# EAGLE design RxBrd_v2 (EAGLE 7.2.0)
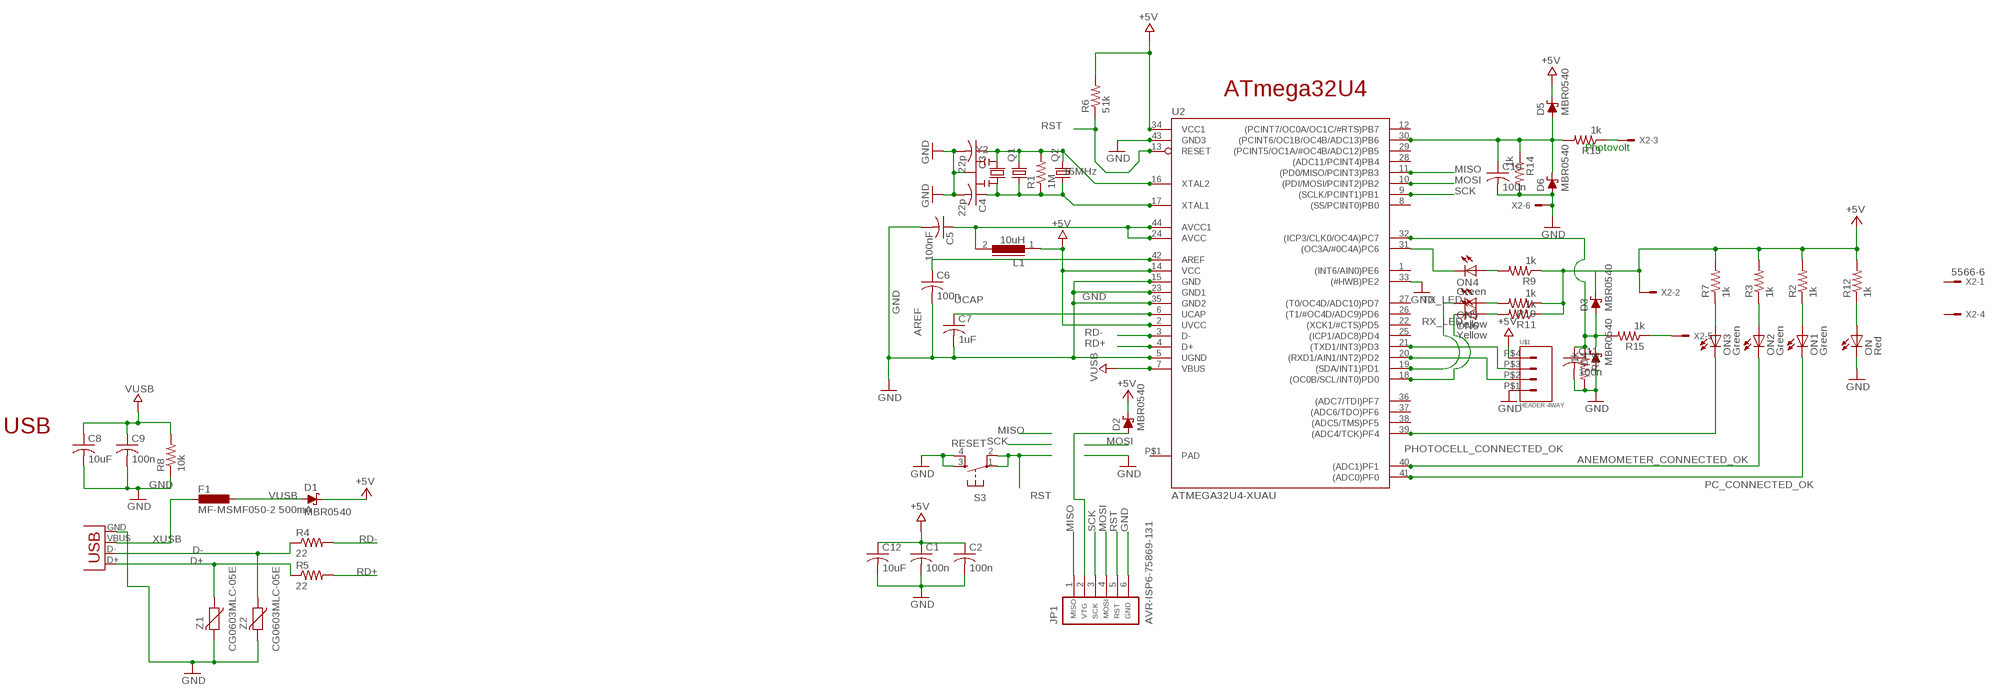
[diagram p0: schematic, sheet 1]

## Parts
C1  100n  C-USC0805  [C0805]
C2  100n  C-USC0805  [C0805]
C3  22p  C-USC0805  [C0805]
C4  22p  C-USC0805  [C0805]
C5  100nF  C-USC0805  [C0805]
C6  100n  C-USC0805  [C0805]
C7  1uF  C-USC0805  [C0805]
C8  10uF  C-USC0805  [C0805]
C9  100n  C-USC0805  [C0805]
C10  100n  C-USC0805  [C0805]
C11  100n  C-USC0805  [C0805]
C12  10uF  C-USC0805  [C0805]
D1  MBR0540  [SOD123@2]
D2  MBR0540  [SOD123@2]
D3  MBR0540  [SOD123@2]
D4  MBR0540  [SOD123@2]
D5  MBR0540  [SOD123@2]
D6  MBR0540  [SOD123@2]
F1  MF-MSMF050-2 500mA  L-EUL1812  [L1812]
JP1  AVR-ISP6-75869-131  [HDR-75869-131]
L1  10uH  MMICC7  [MMICC7]
ON  Red  LEDCHIPLED_0805  [CHIPLED_0805]
ON1  Green  LEDCHIPLED_0805  [CHIPLED_0805]
ON2  Green  LEDCHIPLED_0805  [CHIPLED_0805]
ON3  Green  LEDCHIPLED_0805  [CHIPLED_0805]
ON4  Green  LEDCHIPLED_0805  [CHIPLED_0805]
ON5  Yellow  LEDCHIPLED_0805  [CHIPLED_0805]
ON6  Yellow  LEDCHIPLED_0805  [CHIPLED_0805]
Q1  CRYSTALHC49UP  [HC49UP]
Q2  CRYSTALHC49S  [HC49/S]
R1  1M  R-US_R0805  [R0805]
R2  1k  R-US_R0805  [R0805]
R3  1k  R-US_R0805  [R0805]
R4  22  R-US_R0805  [R0805]
R5  22  R-US_R0805  [R0805]
R6  51k  R-US_R0805  [R0805]
R7  1k  R-US_R0805  [R0805]
R8  10k  R-US_R0805  [R0805]
R9  1k  R-US_R0805  [R0805]
R10  1k  R-US_R0805  [R0805]
R11  1k  R-US_R0805  [R0805]
R12  1k  R-US_R0805  [R0805]
R13  1k  R-US_R0805  [R0805]
R14  1k  R-US_R0805  [R0805]
R15  1k  R-US_R0805  [R0805]
R16  1k  R-US_R0805  [R0805]
S3  RESET  TAC_SWITCHSMD  [TACTILE_SWITCH_SMD]
U2  ATMEGA32U4-XUAU  [TQFP44-PAD]
U$1  HEADER-4WAY  [1744426-4]
X1  USBPTH  [USB-B-PTH]
X2  5566-6  [5566-6]
Y2  16MHz  RESONATORMU  [RESONATOR]
Z1  CG0603MLC-05E  VARISTORCN0603  [CT/CN0603]
Z2  CG0603MLC-05E  VARISTORCN0603  [CT/CN0603]

## Nets
+5V [usbvcc]: C1.1 C2.1 C12.1 D1.C D2.C D3.C D5.C L1.1 R2.2 R3.2 R6.2 R7.2 R9.1 R10.1 R11.1 R12.2 U2.2(UVCC) U2.14(VCC) U2.34(VCC1) U$1.P$4 X2.2
ANEMOMETER_CONNECTED_OK: ON2.C U2.40((ADC1)PF1)
AREF [aref]: C6.1 U2.42(AREF)
AVCC: C5.1 L1.2 U2.24(AVCC) U2.44(AVCC1)
D+: R5.1 X1.D+ Z1.1
D-: R4.1 X1.D- Z2.1
GND [gnd]: C1.2 C2.2 C3.2 C4.2 C5.2 C6.2 C7.2 C8.2 C9.2 C10.2 C11.2 C12.2 D4.A D6.A JP1.6 ON.C R8.1 R14.2 R16.2 S3.3 S3.4 U2.5(UGND) U2.15(GND) U2.23(GND1) U2.33((#HWB)PE2) U2.35(GND2) U2.43(GND3) U$1.P$1 X1.GND X2.6 Y2.2 Z1.2 Z2.2
MISO: JP1.1 U2.11((PD0/MISO/PCINT3)PB3)
MOSI: JP1.4 U2.10((PDI/MOSI/PCINT2)PB2)
N$1: C11.1 D3.A D4.C R15.2 R16.1 U2.32((ICP3/CLK0/OC4A)PC7)
N$2: ON3.A R7.1
N$3: ON.A R12.1
N$4: R13.1 X2.3
N$5: C10.1 D5.A D6.C R13.2 R14.1 U2.30((PCINT6/OC1B/OC4B/ADC13)PB6)
N$6: ON4.A R9.2
N$7: U2.20((RXD1/AIN1/INT2)PD2) U$1.P$2
N$8: U2.21((TXD1/INT3)PD3) U$1.P$3
N$9: ON2.A R3.1
N$10 [usbvcc]: D2.A JP1.2
N$11: ON1.A R2.1
N$12: ON5.A R10.2
N$13: ON4.C U2.31((OC3A/#0C4A)PC6)
N$14: ON6.A R11.2
N$15: R15.1 X2.5
PC_CONNECTED_OK: ON1.C U2.41((ADC0)PF0)
PHOTOCELL_CONNECTED_OK: ON3.C U2.39((ADC4/TCK)PF4)
RD+: R5.2 U2.4(D+)
RD-: R4.2 U2.3(D-)
RST: JP1.5 R6.1 S3.1 S3.2 U2.13(RESET)
RX_LED: ON6.C U2.18((OC0B/SCL/INT0)PD0)
SCK: JP1.3 U2.9((SCLK/PCINT1)PB1)
TX_LED: ON5.C U2.19((SDA/INT1)PD1)
UCAP: C7.1 U2.6(UCAP)
VUSB: C8.1 C9.1 D1.A F1.1 R8.2 U2.7(VBUS)
XTAL1: C4.1 Q1.1 Q2.1 R1.1 U2.17(XTAL1) Y2.3
XTAL2: C3.1 Q1.2 Q2.2 R1.2 U2.16(XTAL2) Y2.1
XUSB [usbvcc]: F1.2 X1.VBUS
Unconnected: U2.1((INT6/AIN0)PE6) U2.8((SS/PCINT0)PB0) U2.12((PCINT7/OC0A/OC1C/#RTS)PB7) U2.22((XCK1/#CTS)PD5) U2.25((ICP1/ADC8)PD4) U2.26((T1/#OC4D/ADC9)PD6) U2.27((T0/OC4D/ADC10)PD7) U2.28((ADC11/PCINT4)PB4) U2.29((PCINT5/OC1A/#OC4B/ADC12)PB5) U2.36((ADC7/TDI)PF7) U2.37((ADC6/TDO)PF6) U2.38((ADC5/TMS)PF5) X2.1 X2.4

## Notes on the sheet
- ATmega32U4
- Photovolt
- USB

## Power pins joined to a net without a drawn wire
PAD: U2.P$1(PAD)

## Library data of the parts
C1-C12 = resistor:C-US: CAPACITOR, American symbol
D1-D6 = diode:MBR0540: schottky diode, 0.5A, 40V ON Semiconductor
F1 = rcl:L-EU: INDUCTOR, European symbol
JP1 = atmel-avr:AVR-ISP6-: AVR ISP-6 Serial Programming Header
L1 = inductors:MMICC7: INDUCTOR
ON ON1-ON6 = led:LED: LED OSRAM: - CHIPLED LG R971, LG N971, LY N971, LG Q971, LY Q971, LO R971, LY R971 LH N974, LH R974 LS Q976, LO Q976, LY Q976 LO Q996 - Hyper CHIPLED LW Q18S LB Q993, LB Q99A, LB R99A - SideLED LS A670, LO A670, LY A670, LG A670, LP A670 LB A673, LV A673, LT A673, LW A673 LH A674 LY A675 LS A676, LA A676, LO A676, LY A676, LW A676 LS A679, LY A679, LG A679 - Hyper Micro SIDELED® LS Y876, LA Y876, LO Y876, LY Y876 LT Y87S - SmartLED LW L88C, LW L88S LB L89C, LB L89S, LG L890 LS L89K, LO L89K, LY L89K LS L896, LA L896, LO L896, LY L896 - TOPLED LS T670, LO T670, LY T670, LG T670, LP T670 LSG T670, LSP T670, LSY T670, LOP T670, LYG T670 LG T671, LOG T671, LSG T671 LB T673, LV T673, LT T673, LW T673 LH T674 LS T676, LA T676, LO T676, LY T676, LB T676, LH T676, LSB T676, LW T676 LB T67C, LV T67C, LT T67C, LS T67K, LO T67K, LY T67K, LW E67C LS E67B, LA E67B, LO E67B, LY E67B, LB E67C, LV E67C, LT E67C LW T67C LS T679, LY T679, LG T679 LS T770, LO T770, LY T770, LG T770, LP T770 LB T773, LV T773, LT T773, LW T773 LH T774 LS E675, LA E675, LY E675, LS T675 LS T776, LA T776, LO T776, LY T776, LB T776 LHGB T686 LT T68C, LB T68C - Hyper Mini TOPLED® LB M676 - Mini TOPLED Santana® LG M470 LS M47K, LO M47K, LY M47K Source: http://www.osram.convergy.de LUXEON: - LUMILED® LXK2-PW12-R00, LXK2-PW12-S00, LXK2-PW14-U00, LXK2-PW14-V00 LXK2-PM12-R00, LXK2-PM12-S00, LXK2-PM14-U00 LXK2-PE12-Q00, LXK2-PE12-R00, LXK2-PE12-S00, LXK2-PE14-T00, LXK2-PE14-U00 LXK2-PB12-K00, LXK2-PB12-L00, LXK2-PB12-M00, LXK2-PB14-N00, LXK2-PB14-P00, LXK2-PB14-Q00 LXK2-PR12-L00, LXK2-PR12-M00, LXK2-PR14-Q00, LXK2-PR14-R00 LXK2-PD12-Q00, LXK2-PD12-R00, LXK2-PD12-S00 LXK2-PH12-R00, LXK2-PH12-S00 LXK2-PL12-P00, LXK2-PL12-Q00, LXK2-PL12-R00 Source: www.luxeon.com KINGBRIGHT: KA-3528ASYC Source: www.kingbright.com
Q1 = crystal:CRYSTAL: CRYSTAL; OC_FARNELL: unknown; OC_NEWARK: unknown
Q2 = crystal:CRYSTAL: CRYSTAL; OC_FARNELL: 1667008; OC_NEWARK: unknown
R1-R16 = resistor:R-US_: RESISTOR, American symbol
S3 = SparkFun:TAC_SWITCH: Momentary Switch Button commonly used for reset or general input. Spark Fun Electronics SKU : COM-00097
U2 = SmartPrj:ATMEGA32U4-XU
U$1 = con-TE-EP:HEADER-4WAY
X1 = SparkFun:USB: USB Connectors USB-B-PTH is fully proven SKU : PRT-00139 USB-miniB is fully proven SKU : PRT-00587 USB-A-PCB is untested. USB-A-H is throughly reviewed, but untested. Spark Fun Electronics SKU : PRT-00437 USB-B-SMT is throughly reviewed, but untested. Needs silkscreen touching up. USB-A-S has not been used/tested USB-MB-H has not been used/tested
X2 = con-molex:5566-6: Mini FIT connector 6 pol Source: http://www.molex.com; MPN: 95566-61002; OC_FARNELL: unknown; OC_NEWARK: 22K8620
Y2 = SmartPrj:RESONATOR
Z1 Z2 = varistor:VARISTOR: VARISTOR

## Net classes
0 default: width 0.152 mm, drill 0.305 mm, clearance 0.152 mm
1 power: width 0.254 mm, drill 0.61 mm, clearance 0.254 mm
2 gnd: width 0.254 mm, drill 0.61 mm, clearance 0.254 mm
3 usbvcc: width 0.254 mm, drill 0.61 mm, clearance 0.254 mm
4 aref: width 0.254 mm, drill 0.61 mm, clearance 0.254 mm

## Board
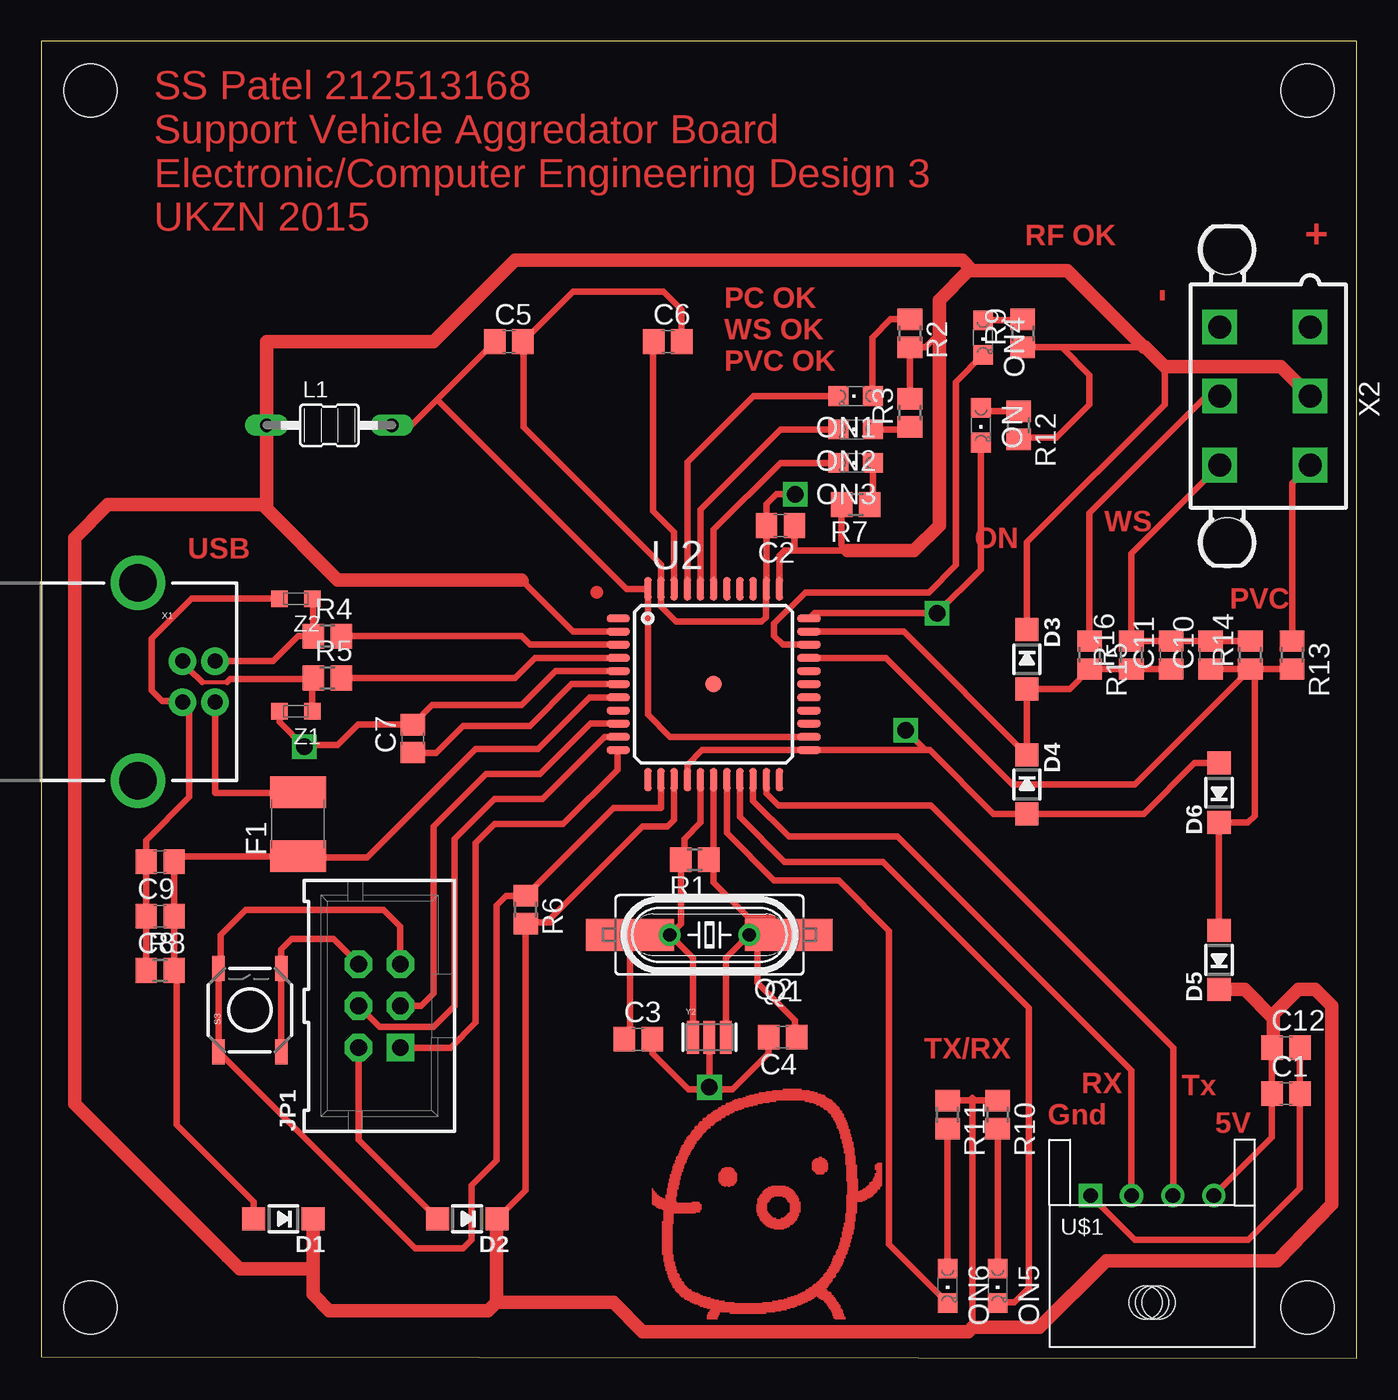
[diagram p1: board, top side]
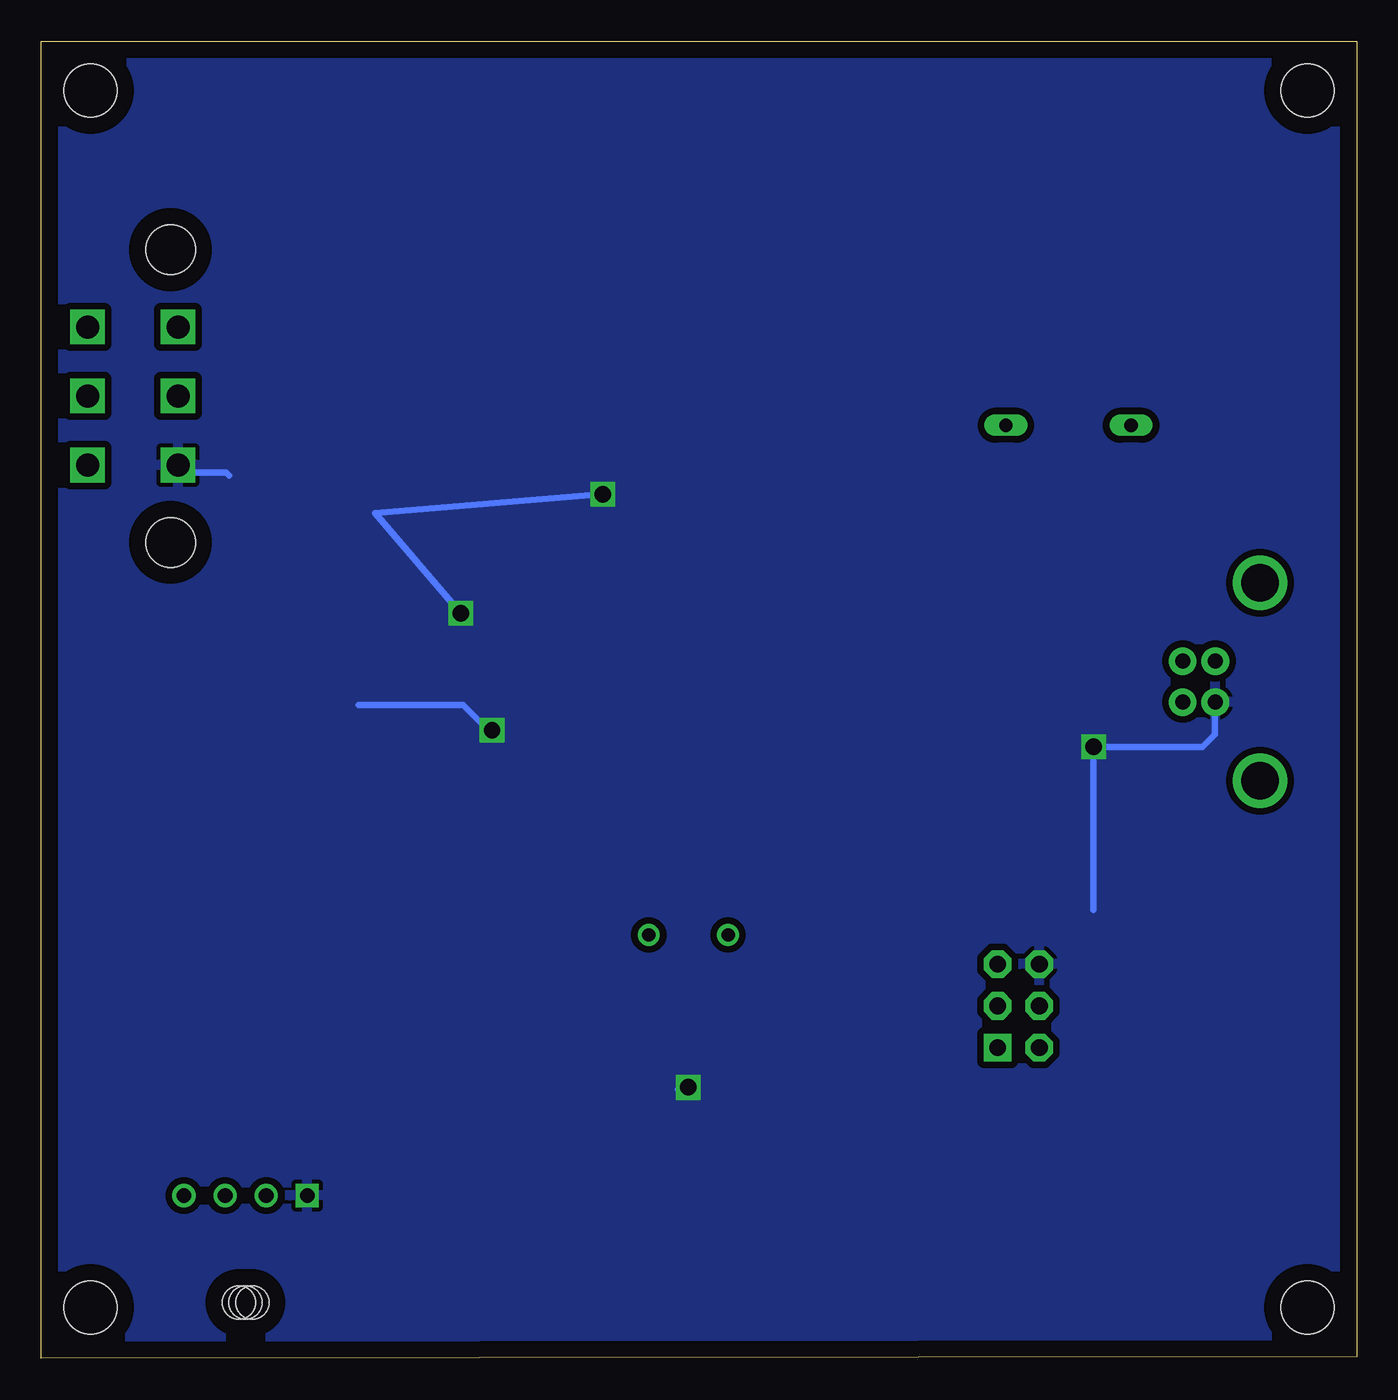
[diagram p2: board, bottom side, seen from below]

Size 80 x 80.1 mm. Coordinates in mm from the lower left corner, seen from the top.
Outline: 0,0.1 80,0 80,80.1 0,80.1 0,0.1
Copper layers (1*16): Top 0.035mm / dielectric 1.5mm / Bottom 0.035mm
Design rules "default": minimum track width 10mil, minimum drill 24mil, track to track 8mil, track to pad 8mil, pad to pad 8mil, via to via 8mil, smd to smd 8mil, copper to edge 40mil, drill to drill 8mil, minimum pad ring 10mil, minimum via ring 8mil, stop-mask expansion 4mil, vias tented up to drill 0mil, thermal gap 10mil
Holes 3.2 mm at 3,3.1 77,3.1 77,77.1 3,77.1

### Footprints (pad centres in the part's own frame; a part is rotated, then mirrored left to right if it is on the bottom)
C0805 = smd 1.3 x 1.5: 1 -0.85,0; 2 0.85,0
SOD123@2 = smd 1.4 x 1.4: A 1.805,0; C -1.805,0
L1812 = smd 1.9 x 3.4: 1 -1.95,0; 2 1.95,0
HDR-75869-131 = drill 1.016 pad 1.676 square: 1 -2.54,-1.27 | drill 1.016 pad 1.676 octagon: 2 -2.54,1.27; 3 0,-1.27; 4 0,1.27; 5 2.54,-1.27; 6 2.54,1.27
MMICC7 = drill 0.813 long: 1 -3.81,0; 2 3.81,0
CHIPLED_0805 = smd 1.2 x 1.2: A 0,-1.05; C 0,1.05
HC49UP = smd 5.334 x 1.93: 1 -4.826,0; 2 4.826,0
HC49/S = drill 0.813: 1 -2.413,0; 2 2.413,0
R0805 = smd 1.3 x 1.5: 1 -0.85,0; 2 0.85,0
TACTILE_SWITCH_SMD = smd 1.524 x 0.762: 1 -2.54,1.905; 2 2.54,1.905; 3 -2.54,-1.905; 4 2.54,-1.905
TQFP44-PAD = smd 1.4 x 0.45: 1 -5.8,4; 2 -5.8,3.2; 3 -5.8,2.4; 4 -5.8,1.6; 5 -5.8,0.8; 6 -5.8,0; 7 -5.8,-0.8; 8 -5.8,-1.6; 9 -5.8,-2.4; 10 -5.8,-3.2; 11 -5.8,-4; 23 5.8,-4; 24 5.8,-3.2; 25 5.8,-2.4; 26 5.8,-1.6; 27 5.8,-0.8; 28 5.8,0; 29 5.8,0.8; 30 5.8,1.6; 31 5.8,2.4; 32 5.8,3.2; 33 5.8,4 | smd 0.45 x 1.4: 12 -4,-5.8; 13 -3.2,-5.8; 14 -2.4,-5.8; 15 -1.6,-5.8; 16 -0.8,-5.8; 17 0,-5.8; 18 0.8,-5.8; 19 1.6,-5.8; 20 2.4,-5.8; 21 3.2,-5.8; 22 4,-5.8; 34 4,5.8; 35 3.2,5.8; 36 2.4,5.8; 37 1.6,5.8; 38 0.8,5.8; 39 0,5.8; 40 -0.8,5.8; 41 -1.6,5.8; 42 -2.4,5.8; 43 -3.2,5.8; 44 -4,5.8 | smd 1 x 1: P$1 0,0
1744426-4 = drill 0.9 square: P$1 -3.75,6.5 | drill 0.9: P$2 -1.25,6.5; P$3 1.25,6.5; P$4 3.75,6.5 | hole 2: 0,0; -0.4,0; 0.4,0
USB-B-PTH = drill 0.914 pad 1.676: D+ 0,1.25; D- 1.981,1.25; GND 0,-1.25; VBUS 1.981,-1.25 | drill 2.286: P$1 -2.718,-6.02; P$2 -2.718,6.02
5566-6 = drill 1.4 square: 1 4.2,-2.75; 2 0,-2.75; 3 -4.2,-2.75; 4 4.2,2.75; 5 0,2.75; 6 -4.2,2.75 | hole 3: 8.9,2.29; -8.9,2.29
RESONATOR = smd 0.7 x 2: 1 -1,0; 2 0,0; 3 1,0
CT/CN0603 = smd 1 x 1: 1 -1,0; 2 1,0

### Placement (x,y rotation side)
C1  75.69,16.1 0 top
C2  44.96,50.65 180 top
C3  36.32,19.4 0 top
C4  45.09,19.53 180 top
C5  28.45,61.82 0 top
C6  38.1,61.82 0 top
C7  22.61,37.69 90 top
C8  7.24,26.9 180 top
C9  7.24,30.2 180 top
C10  71.12,42.77 90 top
C11  68.71,42.77 90 top
C12  75.69,18.9 0 top
D1  14.73,8.48 180 top
D2  25.91,8.48 180 top
D3  59.94,42.52 270 top
D4  59.94,34.9 270 top
D5  71.63,24.23 90 top
D6  71.63,34.39 90 top
F1  15.62,32.48 90 top
JP1  20.57,21.44 90 top
L1  17.53,56.74 0 top
ON  57.15,56.74 180 top
ON1  49.53,58.52 90 top
ON2  49.53,56.49 90 top
ON3  49.53,54.46 90 top
ON4  57.28,62.08 180 top
ON5  58.17,4.42 180 top
ON6  55.12,4.42 180 top
Q1  40.64,25.75 180 top
Q2  40.64,25.75 180 top
R1  39.75,30.33 180 top
R2  52.83,62.33 270 top
R3  52.83,57.5 90 top
R4  17.4,43.91 0 top
R5  17.4,41.38 0 top
R6  29.46,27.28 270 top
R7  49.53,51.92 180 top
R8  7.24,23.6 0 top
R9  59.69,62.33 90 top
R10  58.17,14.83 270 top
R11  55.12,14.83 270 top
R12  59.44,56.74 270 top
R13  76.07,42.77 270 top
R14  73.53,42.77 90 top
R15  63.75,42.77 270 top
R16  66.29,42.77 90 top
S3  12.7,21.18 90 top
U2  40.89,40.99 0 top
U$1  67.56,3.4 0 top
X1  8.6,41.15 0 top
X2  74.42,58.52 90 top
Y2  40.64,19.53 0 top
Z1  15.49,39.34 180 top
Z2  15.49,46.2 180 top

### Tracks (layer width: path | path; a pad name or v marks a point on that pad's centre or on a via)
+5V
  Top 0.406: U2.34 44.89,48.8 45.21,49.12 45.72,49.12 | R3.2 R2.2 53.76,61.48 54.61,62.33 | 13.72,51.66 13.72,51.92 | 27.69,8.46 D2.C 29.46,10.23 29.46,26.26 | 29.46,26.26 R6.2 29.55,26.52 29.72,26.52 | R10.1 56.64,15.68 | 56.64,15.68 R11.1 | 29.46,47.09 29.21,47.34 29.46,47.34 29.46,47.09 | U2.2 32.36,44.19 29.46,47.09 | 30.99,26.52 30.86,26.52 | 30.86,26.52 29.72,26.52 | 29.72,26.52 29.46,26.26 | 67.14,61.48 67.06,61.48 R9.1 62.06,61.48 63.75,59.79 63.75,58.01 61.72,55.98 59.52,55.98 R12.2 | 56.39,66.14 56.64,66.14 | U$1.P$4 74.84,13.43 C1.1 C12.1 74.93,18.98 | 56.39,1.62 56.64,1.88 56.64,15.68 | 74.93,20.93 74.93,20.67 | 56.64,15.85 56.64,15.68 | 45.72,49.12 49.02,49.12 48.68,49.46 R7.2 | 16.38,5.43 16.38,5.33 16.54,5.18 | C2.1 45.81,49.21 45.72,49.12 | D3.C 59.94,49.63 68.33,58.01 68.33,60.3 | U2.14 38.48,32.74 38.1,32.36 36.58,32.36 30.86,26.64 30.86,26.52
  Top 0.813: 29.21,47.34 18.03,47.34 13.72,51.66 | D1.C 16.54,5.18 16.54,3.88 17.53,2.89 27.18,2.89 27.69,3.4 | 27.69,3.4 27.69,8.46 | 67.14,61.48 68.33,60.3 75.39,60.3 X2.2 | 56.39,66.14 54.61,64.36 54.61,62.33 54.61,50.65 53.09,49.12 49.02,49.12 | 67.06,61.48 62.4,66.14 56.64,66.14 56.01,66.77 28.83,66.77 23.88,61.82 13.72,61.82 L1.1 13.72,51.92 4.06,51.92 2.03,49.88 2.03,15.47 12.06,5.43 16.38,5.43 | 27.69,3.4 34.8,3.4 36.58,1.62 56.39,1.62 | 56.64,1.88 60.71,1.88 64.77,5.94 75.18,5.94 78.49,9.37 78.49,21.44 77.47,22.45 76.45,22.45 74.93,20.93 | 74.93,18.98 74.93,20.67 73.18,22.43 D5.C
ANEMOMETER_CONNECTED_OK
  Top 0.406: U2.40 40.09,51.62 44.96,56.49 ON2.C
AREF
  Top 0.406: 37.34,61.73 C6.1 37.21,61.78 37.21,51.54 38.49,50.25 U2.42
AVCC
  Top 0.406: U2.24 38.25,37.79 36.89,39.15 U2.44 35.6,46.79 24.09,58.31 | L1.2 22.52,56.74 24.09,58.31 | 24.09,58.31 C5.1
D+
  Top 0.254: 9.78,41.12 11.3,41.12
  Top 0.406: Z1.1 16.49,41.32 | 16.49,41.32 R5.1 | 16.49,41.32 11.5,41.32 11.3,41.12 | 9.78,41.12 9.02,41.88 9.02,41.98 X1.D+
D-
  Top 0.406: X1.D- 14.11,42.4 15.62,43.91 R4.1 16.55,46.15 Z2.1
GND  (via drill 1)
  Top 0.406: S3.3 S3.4 14.61,24.87 15.24,25.5 17.78,25.5 JP1.6 | R8.1 C8.2 C9.2 | U2.15 39.29,36.09 40.2,36.99 U2.23 53.78,36.99 | D6.A 70.13,36.2 67.06,33.12 59.97,33.12 D4.A 59.92,33.12 57.91,33.12 54.04,36.99 53.78,36.99 | C6.2 38.95,63.77 37.85,64.87 32.35,64.87 C5.2 29.34,61.78 29.34,56.62 37.69,48.26 U2.43 37.69,45.72 38.61,44.8 43.81,44.8 44.07,45.06 44.07,46.77 U2.35 44.09,50.63 C2.2 44.11,51.95 44.7,52.55 v45.85,52.55 | 6.13,29.95 C9.2 | 53.78,36.99 v52.58,38.2 | C12.2 C1.2 76.54,10.35 73.41,7.21 66.5,7.21 U$1.P$1 | C9.2 6.39,31.51 9.02,34.14 9.02,39.48 X1.GND 8.52,39.98 7.37,39.98 6.73,40.61 6.73,43.79 9.14,46.2 Z2.2 | Z1.2 14.49,38.69 v16,37.18 16.13,37.31 18.03,37.31 19.27,38.54 C7.2 23.79,39.72 29.21,39.72 31.28,41.79 U2.5 | X2.6 66.29,48.94 R16.2 C11.2 R14.2 C10.2 | Y2.2 v40.64,16.48 | C3.2 37.17,18.55 39.37,16.36 40.51,16.36 v40.64,16.48 | C4.2 44.23,18.55 42.04,16.36 40.77,16.36 v40.64,16.48 | ON.C 57.15,47.98 v54.48,45.31 47.01,45.31 U2.33
  Bottom 0.406: X1.GND 8.64,39.86 8.64,37.95 9.4,37.18 v16,37.18 16,27.28 | v52.58,38.2 52.83,38.2 54.36,39.72 60.71,39.72 | X2.6 72.14,53.86 68.74,53.86 68.58,53.69 | v45.85,52.55 59.69,51.41 v54.48,45.31 | v40.64,16.48 41.15,16.48 41.27,16.36
  pour Bottom (isolate 0.406): 0,0.1 0,80.3 79.8,80 79.9,0.3
MISO
  Top 0.406: U2.11 35.05,36.95 35.05,35.79 31.75,32.48 27.56,32.48 26.42,31.34 26.42,20.42 24.89,18.9 JP1.1
MOSI
  Top 0.406: U2.10 34.27,37.79 30.48,34.01 27.56,34.01 25.15,31.6 25.15,21.44 23.88,20.17 20.57,20.17 JP1.4
N$1
  Top 0.406: U2.32 52.45,44.19 D4.C D3.A 62.55,40.71 R15.2 R16.1 C11.1
N$2
  Top 0.406: ON3.A 50.58,52.12 R7.1
N$3
  Top 0.406: R12.1 57.6,57.59 ON.A
N$4
  Top 0.406: R13.1 76.07,53.22 X2.3
N$5
  Top 0.406: D5.A D6.C 73.38,32.59 73.79,32.99 73.79,41.67 R14.1 | U2.30 51.36,42.59 59.05,34.9 66.51,34.9 R14.1 | C10.1 R14.1 | R14.1 R13.2
N$6
  Top 0.406: ON4.A 59.64,63.13 R9.2
N$7
  Top 0.406: U2.20 43.29,33.9 45.47,31.72 52.07,31.72 66.29,17.5 66.29,9.92 U$1.P$2
N$8
  Top 0.406: U2.21 44.09,34.37 44.83,33.63 54.1,33.63 68.83,18.9 68.83,9.92 U$1.P$3
N$9
  Top 0.406: ON2.A 52.67,56.49 R3.1
N$10
  Top 0.406: D2.A 19.3,13.28 JP1.2
N$11
  Top 0.406: R2.1 51.65,63.18 50.55,62.08 50.55,58.55 ON1.A
N$12
  Top 0.406: R10.2 ON5.A
N$13
  Top 0.406: 57.4,61.06 ON4.C 55.63,59.38 55.63,48.23 53.98,46.58 46.48,46.58 44.58,44.68 44.58,43.91 45.1,43.39 U2.31
N$14
  Top 0.406: R11.2 ON6.A
N$15
  Top 0.406: X2.5 70.87,58.52 63.75,51.41 R15.1
PC_CONNECTED_OK
  Top 0.406: U2.41 39.29,54.51 43.31,58.52 ON1.C
PHOTOCELL_CONNECTED_OK
  Top 0.406: U2.39 40.89,50.39 44.96,54.46 ON3.C
RD+
  Top 0.406: U2.4 30.05,42.59 28.83,41.38 R5.2
RD-
  Top 0.406: U2.3 29.73,43.39 29.21,43.91 R4.2
RST
  Top 0.406: U2.13 37.69,33.48 34.81,33.48 R6.1 28.28,28.13 27.69,27.53 27.69,12.04 26.16,10.51 26.16,7.21 25.65,6.7 22.73,6.7 S3.1 S3.2 10.92,23.85 10.92,25.75 12.45,27.28 20.83,27.28 21.84,26.26 JP1.5
RX_LED
  Top 0.406: U2.18 41.69,31.94 44.58,29.06 48.51,29.06 51.56,26.01 51.56,6.92 ON6.C
SCK
  Top 0.406: U2.9 33.41,38.59 30.35,35.53 27.05,35.53 23.88,32.36 23.88,22.2 23.11,21.44 JP1.3
TX_LED
  Top 0.406: U2.19 42.49,32.92 45.21,30.2 51.18,30.2 60.07,21.31 60.07,4.29 59.18,3.4 58.2,3.4 ON5.C
UCAP
  Top 0.406: U2.6 32.26,40.99 29.72,38.45 25.65,38.45 24,36.8 22.64,36.8 C7.1
VUSB
  Top 0.406: 8.43,30.54 C9.1 | C9.1 C8.1 R8.2 8.26,23.43 8.26,14.2 12.93,9.53 D1.A | 8.34,30.45 C9.1 | 15.92,30.83 F1.1 | F1.1 8.81,30.54 C9.1 | U2.7 33.36,40.19 30.23,37.06 26.42,37.06 19.81,30.45 15.7,30.45 F1.1
XTAL1
  Top 0.406: U2.17 40.89,30.2 | 40.89,30.2 40.89,28.93 43.05,26.77 44.45,26.77 Q1.1 45.47,25.63 44.83,25.63 44.83,25.75 44.32,25.75 44.32,26.01 44.2,26.01 44.2,25.75 43.56,25.75 | 43.56,25.75 Q2.1 41.64,24.34 Y2.3 | 43.56,25.75 43.56,22.83 45.85,20.55 45.85,19.62 C4.1 | R1.1 40.77,30.33 40.89,30.2
XTAL2
  Top 0.406: U2.16 40.09,32.57 39.12,31.6 39.12,30.54 R1.2 38.9,26.43 Q2.2 | Q2.2 Q1.2 35.81,19.75 C3.1 | Y2.1 39.64,24.34 Q2.2
XUSB
  Top 0.406: X1.VBUS 10.58,34.38 15.57,34.38 F1.2
(copper drawn outside any net)
  shapes: Top area x528, Top circle x1

### Text on the board
Top: SS Patel 212513168 / Support Vehicle Aggredator Board / Electronic/Computer Engineering Design 3 / UKZN 2015 | RF OK | + | - | PC OK / WS OK / PVC OK | WS | USB | ON | PVC | TX/RX | RX | Tx | Gnd | 5V